# EAGLE design PDM_Microphone_Array_Prototype (EAGLE 9.6.2)
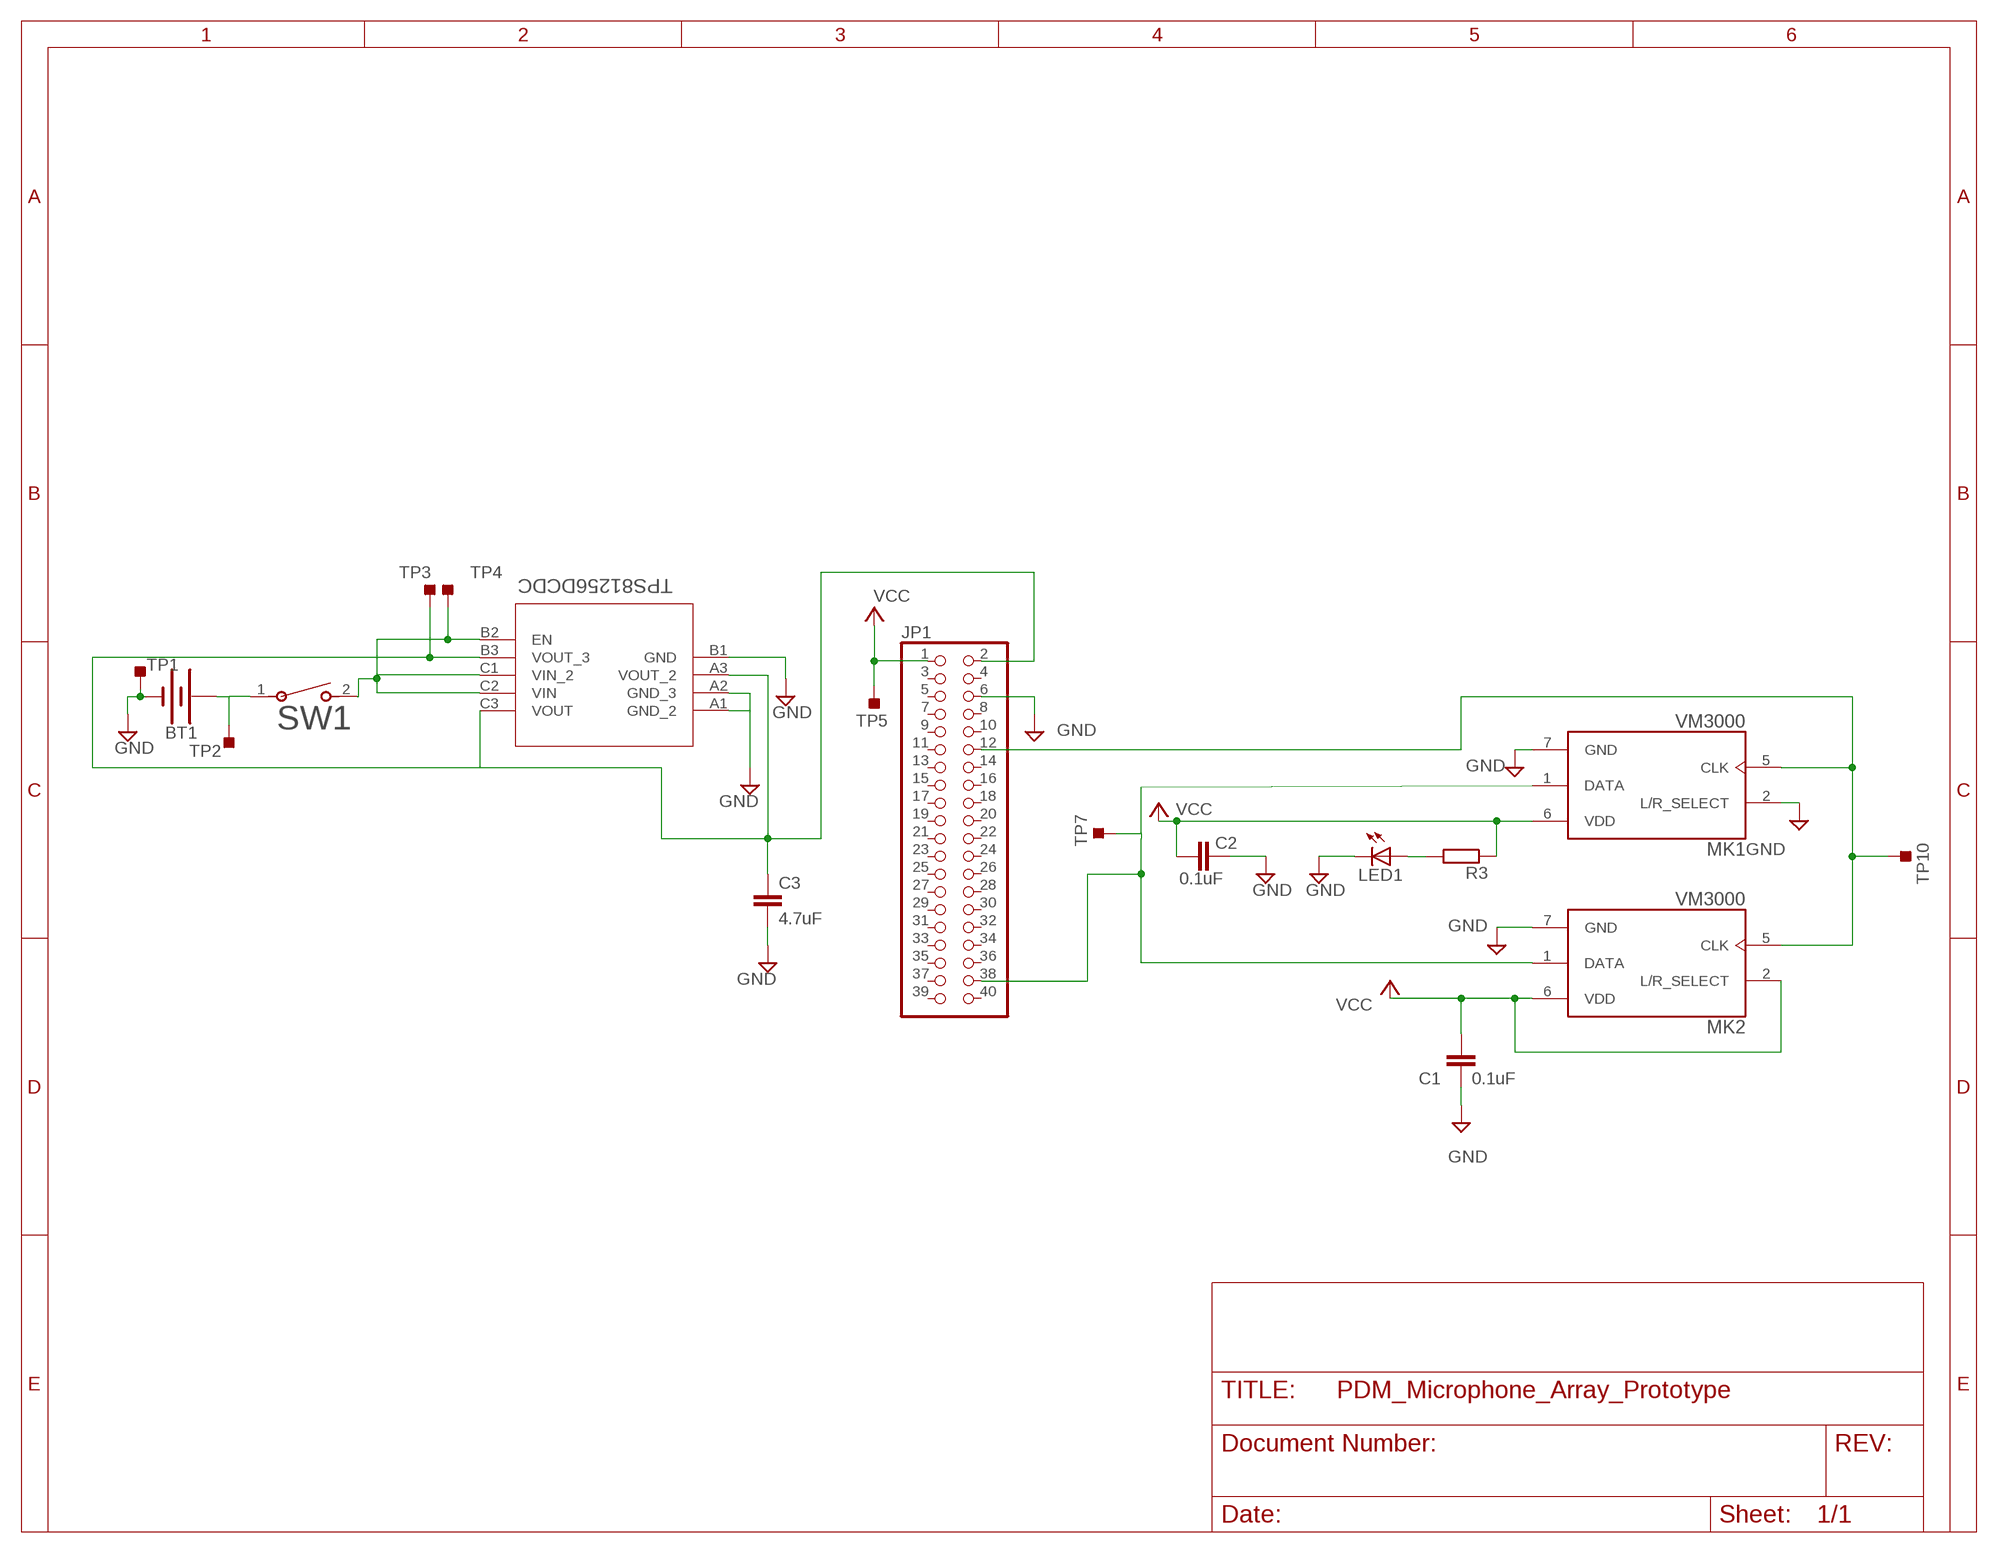
[diagram p0: schematic, sheet 1]

## Parts
BT1  BATTERY-18650  [BATTERY_18650-HOLDER]
C1  0.1uF  0.1UF-0402-6.3V-10%-X7R  [0402]
C2  0.1uF  0.1UF-0402-6.3V-10%-X7R  [0402]
C3  4.7uF  4.7UF-1206-16V-(+80/-20%)  [1206]
JP1  PINHD-2X20  [2X20]
LED1  LEDCHIPLED_0805  [CHIPLED_0805]
MK1  VM3000  [MIC_VM3000]
MK2  VM3000  [MIC_VM3000]
R3  R-EU_R0805  [R0805]
SW1  GF-123-0054  [SW2_GF-123-0054_CWI]
TP1  TESTPOINT_TPS-PAD-036  [TESTPOINT_PAD-036]
TP2  TESTPOINT_TPS-PAD-036  [TESTPOINT_PAD-036]
TP3  TESTPOINT_TPS-PAD-036  [TESTPOINT_PAD-036]
TP4  TESTPOINT_TPS-PAD-036  [TESTPOINT_PAD-036]
TP5  TESTPOINT_TPS-PAD-036  [TESTPOINT_PAD-036]
TP7  TESTPOINT_TPS-PAD-036  [TESTPOINT_PAD-036]
TP10  TESTPOINT_TPS-PAD-036  [TESTPOINT_PAD-036]
TPS81256DCDC  TPS81256SIPRUSIP9_SIP_TEX-L  [USIP9_SIP_TEX-L]

## Nets
GND: BT1.GND@1(-) C1.2 C2.1 C3.2 JP1.6 LED1.C MK1.2(L/R_SELECT) MK1.7(GND) MK2.7(GND) TP1.1(TP) TPS81256DCDC.A1(GND_2) TPS81256DCDC.A2(GND_3) TPS81256DCDC.B1(GND)
N$1: JP1.38 MK1.1(DATA) MK2.1(DATA) TP7.1(TP)
N$2: JP1.12 MK1.5(CLK) MK2.5(CLK) TP10.1(TP)
N$3: LED1.A R3.2
N$4: SW1.2 TP4.1(TP) TPS81256DCDC.B2(EN) TPS81256DCDC.C1(VIN_2) TPS81256DCDC.C2(VIN)
N$5: C3.1 JP1.2 TP3.1(TP) TPS81256DCDC.A3(VOUT_2) TPS81256DCDC.B3(VOUT_3) TPS81256DCDC.C3(VOUT)
N$6: BT1.PWR@1(+) SW1.1 TP2.1(TP)
VCC: C1.1 C2.2 JP1.1 MK1.6(VDD) MK2.2(L/R_SELECT) MK2.6(VDD) R3.1 TP5.1(TP)
Unconnected: JP1.3 JP1.4 JP1.5 JP1.7 JP1.8 JP1.9 JP1.10 JP1.11 JP1.13 JP1.14 JP1.15 JP1.16 JP1.17 JP1.18 JP1.19 JP1.20 JP1.21 JP1.22 JP1.23 JP1.24 JP1.25 JP1.26 JP1.27 JP1.28 JP1.29 JP1.30 JP1.31 JP1.32 JP1.33 JP1.34 JP1.35 JP1.36 JP1.37 JP1.39 JP1.40

## Library data of the parts
BT1 = SparkFun-Batteries:BATTERY: Battery - Single Cell A variety of battery chemistries, sizes, and footprints. Device List: 20MM_PTH - Coin Cell Battery Holder - 20mm (PTH) <https://www.sparkfun.com/products/783> 20MM_PTH_KIT- Coin Cell battery Holder - 20 mm (PTH) <http://www.sparkfun.com/products/783>kit version with special mask 6.8MM_PTH - Coin Cell Battery Holder - 6.8MM(SMD) <https://www.digikey.com/product-detail/en/seiko-instruments/MS621FE-FL11E/728-1057-ND/1889208?WT.srch=1&gclid=CNOQ5a6LzdQCFZS2wAodXCkE0g> 12MM_SMD - Coin Cell Battery Holder - 12mm (SMD) <https://www.sparkfun.com/products/10592> 12MM_PTH - Coin Cell Battery Holder - 12mm (PTH) <https://www.sparkfun.com/products/7948> 20MM_SMD - 20mm Coin Cell Battery Holder (SMD) (2 legs) Used on the Big Time Watch Kit <https://www.sparkfun.com/products/11734> 20MM_SMD_4LEGS - Coin Cell Battery Holder - 20mm (SMD) <https://www.sparkfun.com/products/11892> 20MM_SMD_4LEGS_OVERPASTE - Coin Cell Battery Holder - 20mm (SMD) <https://www.sparkfun.com/products/11892> (Over-paste on the legs) 24.5MM_PTH - Coin Cell Battery Holder - 24.5mm (PTH) <https://www.sparkfun.com/products/8863> 9V - 9V Battery Holder - PC Mount Used on the SparkFun SparkPunk Sound Kit <https://www.sparkfun.com/products/11177> and SparkFun SparkPunk Sequencer Kit <https://www.sparkfun.com/products/12707> 18650 - Battery Holder - 18650 (PTH) <https://www.sparkfun.com/products/13113> AA - Battery Holder - 1xAA (PTH) <https://www.sparkfun.com/products/7949> AAA - Battery Holder - 1xAAA (PTH) <https://www.sparkfun.com/products/12718> AA_KIT - Battery Holder - 1xAA (PTH) <https://www.sparkfun.com/products/7949> Special kit package - pads only have exposed copper on one side of the board. AAA_KIT - Battery Holder - 1xAAA (PTH) <https://www.sparkfun.com/products/12718> Special kit package - pads only have exposed copper on one side of the board.; PROD_ID: BATT-12327; SF_SKU: PRT-13113
C1 C2 = SparkFun-Capacitors:0.1UF: 0.1µF ceramic capacitors A capacitor is a passive two-terminal electrical component used to store electrical energy temporarily in an electric field.; PROD_ID: CAP-14993
C3 = SparkFun-Capacitors:4.7UF: 4.7µF ceramic capacitors A capacitor is a passive two-terminal electrical component used to store electrical energy temporarily in an electric field.; PROD_ID: CAP-10300
JP1 = adafruit:PINHD-2X20: PIN HEADER
LED1 = adafruit:LED: LED OSRAM: - CHIPLED LG R971, LG N971, LY N971, LG Q971, LY Q971, LO R971, LY R971 LH N974, LH R974 LS Q976, LO Q976, LY Q976 LO Q996 - Hyper CHIPLED LW Q18S LB Q993, LB Q99A, LB R99A - SideLED LS A670, LO A670, LY A670, LG A670, LP A670 LB A673, LV A673, LT A673, LW A673 LH A674 LY A675 LS A676, LA A676, LO A676, LY A676, LW A676 LS A679, LY A679, LG A679 - Hyper Micro SIDELED® LS Y876, LA Y876, LO Y876, LY Y876 LT Y87S - SmartLED LW L88C, LW L88S LB L89C, LB L89S, LG L890 LS L89K, LO L89K, LY L89K LS L896, LA L896, LO L896, LY L896 - TOPLED LS T670, LO T670, LY T670, LG T670, LP T670 LSG T670, LSP T670, LSY T670, LOP T670, LYG T670 LG T671, LOG T671, LSG T671 LB T673, LV T673, LT T673, LW T673 LH T674 LS T676, LA T676, LO T676, LY T676, LB T676, LH T676, LSB T676, LW T676 LB T67C, LV T67C, LT T67C, LS T67K, LO T67K, LY T67K, LW E67C LS E67B, LA E67B, LO E67B, LY E67B, LB E67C, LV E67C, LT E67C LW T67C LS T679, LY T679, LG T679 LS T770, LO T770, LY T770, LG T770, LP T770 LB T773, LV T773, LT T773, LW T773 LH T774 LS E675, LA E675, LY E675, LS T675 LS T776, LA T776, LO T776, LY T776, LB T776 LHGB T686 LT T68C, LB T68C - Hyper Mini TOPLED® LB M676 - Mini TOPLED Santana® LG M470 LS M47K, LO M47K, LY M47K Source: http://www.osram.convergy.de/
MK1 MK2 = VM3000:VM3000: MICROPHONE MEMS DIGITAL PDM OMNI Buy Part <https://snapeda.com/parts/VM3000/Vesper%20Technologies%20Inc./view-part/?ref=eda> Check prices <https://snapeda.com/parts/VM3000/Vesper%20Technologies%20Inc./view-part/?ref=eda>; AVAILABILITY: Warning; DESCRIPTION: 20Hz ~ 8kHz Digital, PDM Microphone MEMS (Silicon) 1.6V ~ 3.6V Omnidirectional (-26dB ±1dB @ 94dB SPL) Solder Pads; DIGIKEY-PURCHASE-URL: https://snapeda.com/shop?store=DigiKey&id=4413159; MF: Vesper Technologies Inc.; MP: VM3000; PACKAGE: Vesper Technologies Inc.; PRICE: None
R3 = rcl:R-EU_: RESISTOR, European symbol; SPICEPREFIX: R
SW1 = SPSTSwitch:GF-123-0054; BUILT_BY: EMA_Kyle; COPYRIGHT: Copyright (C) 2018 Accelerated Designs. All rights reserved; DATASHEET: https://media.digikey.com/pdf/Data%20Sheets/CW%20Industries%20PDFs/GF-123-0054_Dwg.pdf; MANUFACTURER_PART_NUMBER: GF-123-0054; SOURCELIBRARY: CW_Industries_2020-03-31; VENDOR: CW Industries
TP1-TP5 TP7 TP10 = 52101-101-REV-A_v16:TESTPOINT_TPS: TEST POINT PAD; BOM: EXCLUDE
TPS81256DCDC = TPS81256:TPS81256SIPR; BUILT_BY: EMA_Cory; COPYRIGHT: Copyright (C) 2018 Accelerated Designs. All rights reserved; DATASHEET: https://www.ti.com/lit/ds/symlink/tps81256.pdf?ts=1591827483446&ref_url=https://www.ti.com/product/TPS81256?HQS%3DTI-null-null-octopart-df-pf-null-wwe; MANUFACTURER_PART_NUMBER: TPS81256SIPR; SOURCELIBRARY: TI_2015-1-5; VENDOR: Texas Instruments

## Net classes
0 default: width 0.305 mm, drill 0.508 mm, clearance 0.254 mm

## Board
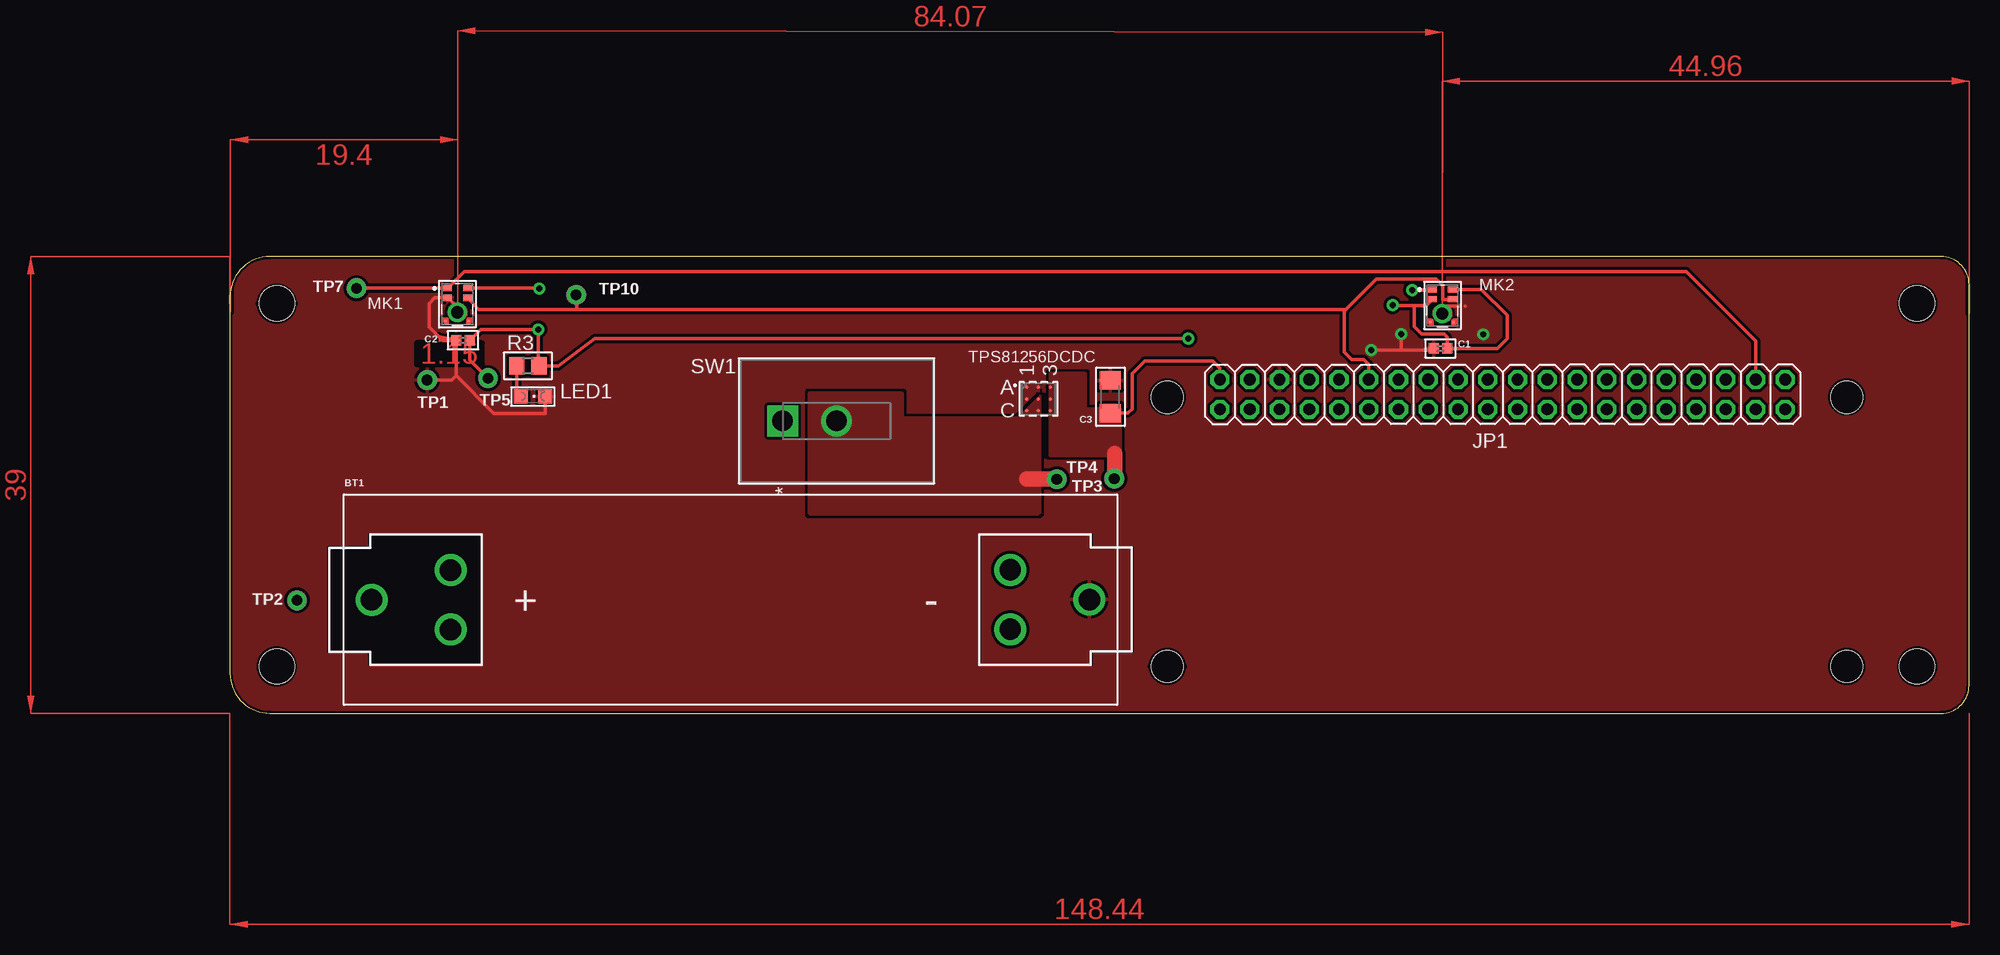
[diagram p1: board, top side]
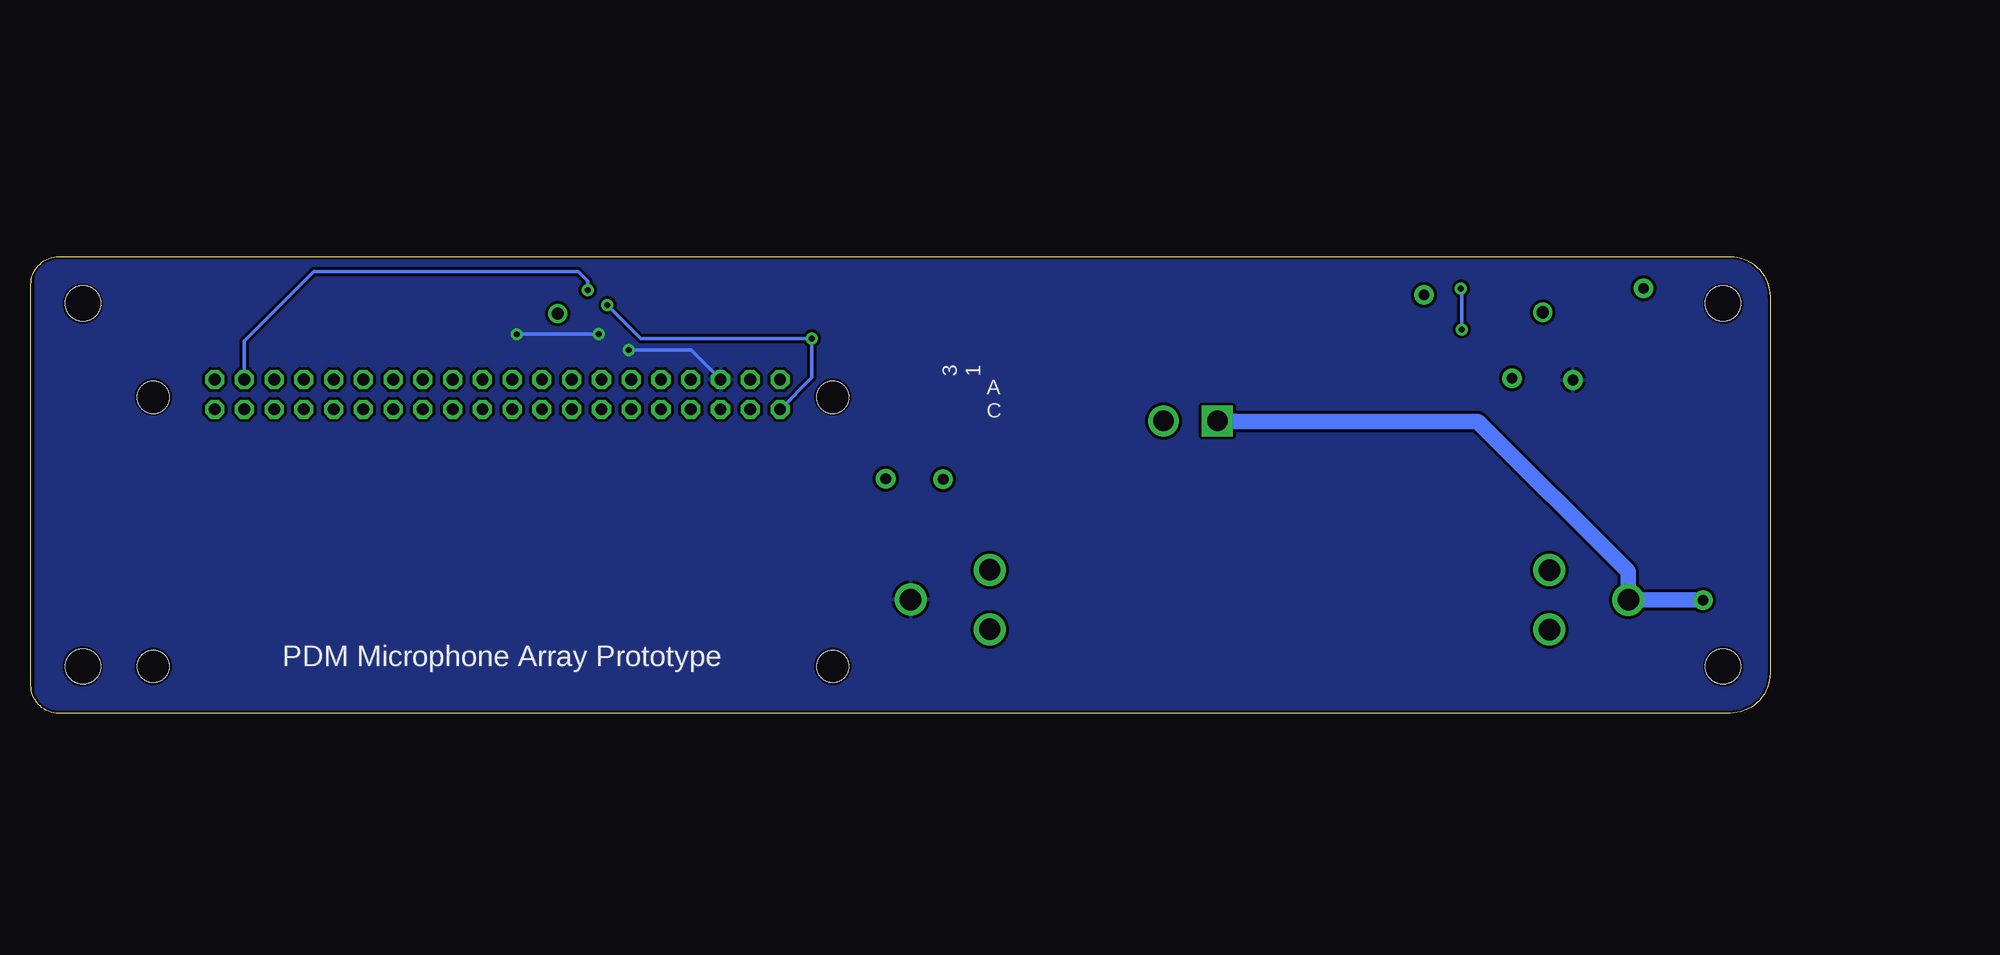
[diagram p2: board, bottom side, seen from below]

Size 148.44 x 39 mm. Coordinates in mm from the lower left corner, seen from the top.
Outline: 148.44,2.38 148.44,36.62 arc90 146.06,39 3.41,39 arc90 0,35.59 0,3.41 arc90 3.41,0 146.06,0 arc90 148.44,2.38
Copper layers (1*16): Top 0.035mm / dielectric 1.5mm / Bottom 0.035mm
Design rules "SparkFun": minimum track width 8mil, minimum drill 20mil, track to track 8mil, track to pad 8mil, pad to pad 8mil, via to via 8mil, smd to smd 8mil, copper to edge 8mil, drill to drill 8mil, minimum pad ring 12mil, minimum via ring 10mil, stop-mask expansion 4mil, vias tented up to drill 20mil, thermal gap 10mil
Holes 2.75 mm at 80,4 80,27 138,27 138,4
Holes 3 mm at 4,4 144,4 4,35 144,35

### Footprints (pad centres in the part's own frame; a part is rotated, then mirrored left to right if it is on the bottom)
BATTERY_18650-HOLDER = drill 1.829: GND@1 30.628,0.01; GND@2 23.88,2.55; GND@3 23.88,-2.53; PWR@1 -30.628,-0.01; PWR@2 -23.88,2.53; PWR@3 -23.88,-2.55
0402 = smd 0.85 x 0.9: 1 -0.58,0; 2 0.58,0
1206 = smd 1.6 x 1.8: 1 -1.4,0; 2 1.4,0
2X20 = drill 1.016 octagon: 1 -24.13,-1.27; 2 -24.13,1.27; 3 -21.59,-1.27; 4 -21.59,1.27; 5 -19.05,-1.27; 6 -19.05,1.27; 7 -16.51,-1.27; 8 -16.51,1.27; 9 -13.97,-1.27; 10 -13.97,1.27; 11 -11.43,-1.27; 12 -11.43,1.27; 13 -8.89,-1.27; 14 -8.89,1.27; 15 -6.35,-1.27; 16 -6.35,1.27; 17 -3.81,-1.27; 18 -3.81,1.27; 19 -1.27,-1.27; 20 -1.27,1.27; 21 1.27,-1.27; 22 1.27,1.27; 23 3.81,-1.27; 24 3.81,1.27; 25 6.35,-1.27; 26 6.35,1.27; 27 8.89,-1.27; 28 8.89,1.27; 29 11.43,-1.27; 30 11.43,1.27; 31 13.97,-1.27; 32 13.97,1.27; 33 16.51,-1.27; 34 16.51,1.27; 35 19.05,-1.27; 36 19.05,1.27; 37 21.59,-1.27; 38 21.59,1.27; 39 24.13,-1.27; 40 24.13,1.27
CHIPLED_0805 = smd 1.2 x 1.2: A 0,-1.05; C 0,1.05
MIC_VM3000 = smd 0.72 x 0.52: 1 -0.84,2.07; 2 -0.84,1.25 | smd 0.2 x 0.2: 3 -1.01,-0.7; 4 0.95,-0.72; 7 -0.03,0.66 | smd 0.73 x 0.52: 5 0.835,1.25; 6 0.835,2.07
R0805 = smd 1.3 x 1.5: 1 -0.95,0; 2 0.95,0
SW2_GF-123-0054_CWI = drill 1.753 pad 2.261 square: 1 0,0 | drill 1.753 pad 2.261: 2 0,-4.597
TESTPOINT_PAD-036 = drill 0.914 pad 1.676: 1 0,0
USIP9_SIP_TEX-L = smd 0.305 x 0.305: A1 -1,1; A2 0,1; A3 1,1; B1 -1,0; B2 0,0; B3 1,0; C1 -1,-1; C2 0,-1; C3 1,-1

### Placement (x,y rotation side)
BT1  42.72,9.7 0 top
C1  103.31,31.15 180 top
C2  19.88,31.85 0 top
C3  75.14,27.03 90 top
JP1  108.63,27.23 0 top
LED1  25.85,27.07 270 top
MK1  19.42,34.23 0 top
MK2  103.49,34.12 0 top
R3  25.42,29.66 180 top
SW1  47.18,24.96 90 top
TP1  16.83,28.46 0 top
TP2  5.71,9.65 0 top
TP3  75.48,20.04 0 top
TP4  70.58,19.99 0 top
TP5  22.02,28.62 0 top
TP7  10.79,36.3 0 top
TP10  29.55,35.74 0 top
TPS81256DCDC  69.01,26.85 0 top

### Tracks (layer width: path | path; a pad name or v marks a point on that pad's centre or on a via)
GND  (via drill 0.51)
  Top 0.305: 19.3,28.85 22.53,25.62 26.9,25.62 LED1.C | 19.3,28.85 C2.1 18.15,31.85 17,33 17,35 17.48,35.48 MK1.2 19.17,34.89 MK1.7 | C1.2 102.61,31.01 100.01,31.01 | 100.01,31.01 100,31 97.42,31 v97.41,31.01 | 100.01,31.01 99.97,31.01 v99.97,32.38 | TP1.1 18.91,28.46 19.3,28.85 | MK2.7 105,34.78 | 105.43,34.78
  Bottom 0.305: JP1.6 92.09,31.01 v97.41,31.01 | v99.97,32.38 106.96,32.38 v106.98,32.37
  pour Top (isolate 0.012, rank 6): 147,39 3.41,39 arc90 0,35.59 0,2 2,0 147,0 149,2 149,37
  pour Bottom (isolate 0.012, rank 6): 147,39 3.41,39 arc90 0,35.59 0,2 2,0 147,0 148,1 148,38
  pour Top (no thermals): 67.37,26.07 69.01,27.71 69.01,28.5 67.3,28.5 67.26,28.47 67.26,25.98 67.28,25.97
N$1  (via drill 0.51)
  Top 0.305: MK2.1 102.6,36.14 v100.91,36.14 | JP1.38 130.22,31.78 124.28,37.72 20,37.72 MK1.1 TP7.1
  Bottom 0.305: v100.91,36.14 100.91,36.91 101.73,37.72 124.28,37.72 130.22,31.78 JP1.38
N$2
  Top 0.305: MK1.5 21.25,34.48 29.59,34.48 | 29.59,34.48 95.23,34.48 | JP1.12 97.2,29.8 96.77,30.23 95.76,30.23 95.12,30.86 95.12,34.37 95.23,34.48 | 95.23,34.48 97.83,37.08 102.95,37.08 103.5,36.53 103.5,35.35 104.31,35.35 MK2.5 | TP10.1 29.59,35.69 29.59,34.48
N$3
  Top 0.305: R3.2 24.47,27.4 LED1.A
N$4
  Top 0.305: TP4.1 70.57,20
  Top 1.33: 70.57,20 68,20
  pour Top (no thermals): 49.43,27.41 57.33,27.41 57.44,27.31 57.44,25.32 67.33,25.32 69.16,27.15 69.16,17.12 68.96,16.93 49.51,16.93 49.38,17.07 49.38,27.28
N$5
  Top 0.305: 74.92,25.85 C3.1 76.63,25.63 77,26 77,29 78.1,30.1 83.9,30.1 84.5,29.5 JP1.2
  Top 1.33: 75.51,22.2 75.51,20.07 TP3.1
  pour Top (no thermals): 70,29 70,22 76,22 76,26 73,26 73,29
N$6
  Bottom 0.305: 5.75,9.69 TP2.1 | 45.68,24.96 45.66,24.94
  Bottom 1.33: BT1.PWR@1 5.75,9.69 | SW1.1 45.68,24.96
  Bottom 1.335: BT1.PWR@1 12.09,12.09 24.94,24.94 45.66,24.94
N$7  (via drill 1.03 pad 1.63)
  other vias: 19.42,34.24
N$8  (via drill 1.03 pad 1.63)
  other vias: 103.49,34.13
VCC  (via drill 0.51)
  Top 0.305: v81.81,32 31.12,32 28.02,29.66 R3.1 26.32,29.7 v26.32,32.79 21.4,32.79 C2.2 20.46,30.18 TP5.1 | 101.09,34.82 102.1,34.82 MK2.2 | 101.09,34.82 99.26,34.82 v99.23,34.85 | MK2.6 106.81,36.19 109,34 109,32 108.15,31.15 C1.1 103.89,32.13 103.63,32.38 101.73,32.38 101.09,33.02 101.09,34.82 | MK1.6 26.34,36.3 v26.38,36.25
  Bottom 0.305: v99.23,34.85 96.39,32 v81.81,32 81.81,28.66 JP1.1 | v26.32,32.79 26.32,36.2 v26.38,36.25
(copper drawn outside any net)
  shapes: Top area x9

### Text on the board
bPlace: PDM Microphone Array Prototype